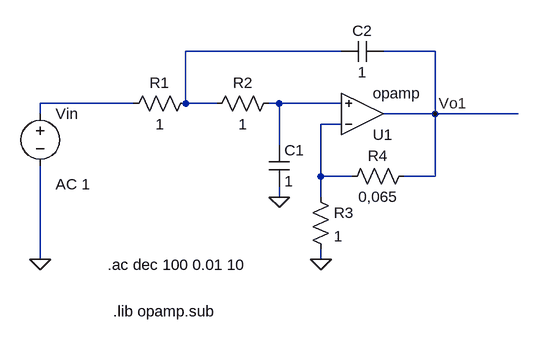
[diagram p0: schematic Tarea_2_Sallen_key.asc]
Tarea_2_Sallen_key.asc, the LTspice schematic file:
Version 4
SHEET 1 2680 680
WIRE 400 48 160 48
WIRE 544 48 464 48
WIRE 80 128 -64 128
WIRE 160 128 160 48
WIRE 208 128 160 128
WIRE 304 128 288 128
WIRE 400 128 304 128
WIRE -64 144 -64 128
WIRE 544 144 544 48
WIRE 544 144 464 144
WIRE 672 144 544 144
WIRE 400 160 368 160
WIRE 304 192 304 128
WIRE 368 240 368 160
WIRE 416 240 368 240
WIRE 544 240 544 144
WIRE 544 240 496 240
WIRE 304 272 304 256
WIRE 368 272 368 240
WIRE -64 368 -64 224
WIRE 368 368 368 352
FLAG -64 368 0
FLAG 368 368 0
FLAG 304 272 0
FLAG 544 144 Vo1
SYMBOL res 176 112 R90
WINDOW 0 0 56 VBottom 2
WINDOW 3 32 56 VTop 2
SYMATTR InstName R1
SYMATTR Value 1
SYMBOL voltage -64 128 R0
WINDOW 123 24 124 Left 2
WINDOW 39 0 0 Left 0
SYMATTR Value2 AC 1
SYMATTR InstName Vin
SYMATTR Value ""
SYMBOL OpAmps\\opamp 432 208 M180
SYMATTR InstName U1
SYMBOL res 304 112 R90
WINDOW 0 0 56 VBottom 2
WINDOW 3 32 56 VTop 2
SYMATTR InstName R2
SYMATTR Value 1
SYMBOL cap 288 192 R0
SYMATTR InstName C1
SYMATTR Value 1
SYMBOL cap 464 32 R90
WINDOW 0 0 32 VBottom 2
WINDOW 3 32 32 VTop 2
SYMATTR InstName C2
SYMATTR Value 1
SYMBOL res 352 256 R0
SYMATTR InstName R3
SYMATTR Value 1
SYMBOL res 512 224 R90
WINDOW 0 0 56 VBottom 2
WINDOW 3 32 56 VTop 2
SYMATTR InstName R4
SYMATTR Value 0,065
TEXT 40 376 Left 2 !.ac dec 100 0.01 10
TEXT 48 448 Left 2 !.lib opamp.sub

The netlist it stands for:
* Tarea_2_Sallen_key.asc
R1 N001 N002 1
Vin N002 0 AC 1
XU1 N004 N003 Vo1 opamp Aol=100K GBW=10Meg  ; pins invin noninvin out
R2 N003 N001 1
C1 N003 0 1
C2 Vo1 N001 1
R3 N004 0 1
R4 Vo1 N004 0,065
.ac dec 100 0.01 10
.lib opamp.sub
.backanno
.end